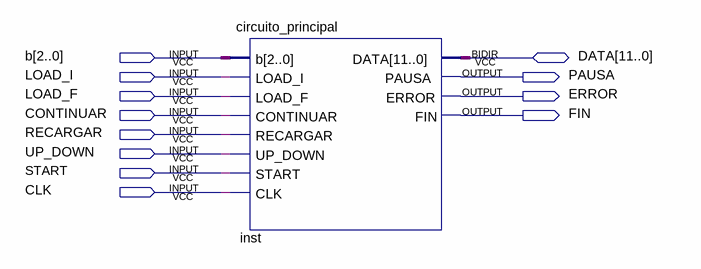
[diagram p0: schematic sheet]
// Quartus schematic circuito_principal_bloque.bdf as structural Verilog: 1 symbols, 12 pins
module circuito_principal_bloque (
  input  [2:0] b,
  input  LOAD_I,
  input  LOAD_F,
  input  CONTINUAR,
  input  RECARGAR,
  input  UP_DOWN,
  input  START,
  input  CLK,
  inout  [11:0] DATA,
  output PAUSA,
  output ERROR,
  output FIN
);

  circuito_principal inst (
    .b(b), .LOAD_I(LOAD_I), .LOAD_F(LOAD_F), .CONTINUAR(CONTINUAR), .RECARGAR(RECARGAR), .UP_DOWN(UP_DOWN),
    .START(START), .CLK(CLK), .PAUSA(PAUSA), .ERROR(ERROR), .FIN(FIN), .DATA(DATA));
endmodule
